# EAGLE design acdr_3.2_updated (EAGLE 7.7.0)
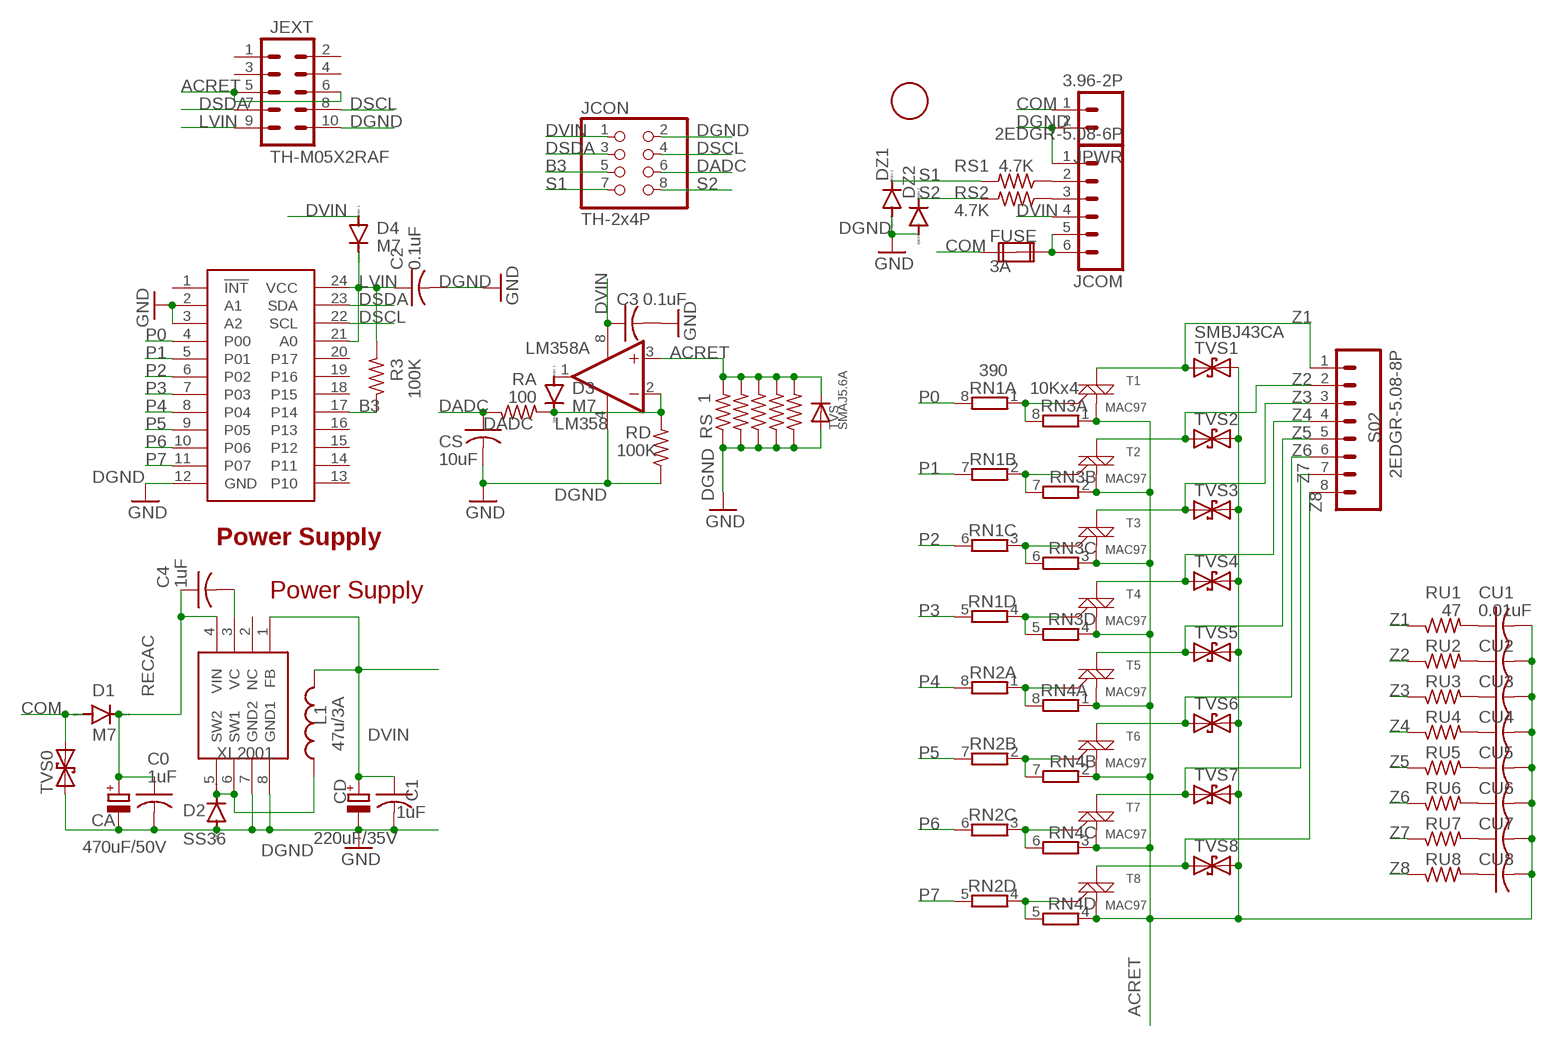
[diagram p0: schematic, sheet 1]

## Parts
1F  FIDUCIAL  [FIDUCIAL_1MM]
C0  1uF  C-USC0603K  [C0603K]
C1  1uF  C-USC0603K  [C0603K]
C2  0.1uF  C-USC0603K  [C0603K]
C3  0.1uF  C-USC0603K  [C0603K]
C4  1uF  C-USC0603K  [C0603K]
CA  470uF/50V  CPOL-EUE5-10.5  [E5-10,5]
CD  220uF/35V  CPOL-EUE3.5-8  [E3,5-8]
CS  10uF  C-USC0805K  [C0805K]
CU1  0.01uF  C-USC0603K  [C0603K]
CU2  0.01uF  C-USC0603K  [C0603K]
CU3  0.01uF  C-USC0603K  [C0603K]
CU4  0.01uF  C-USC0603K  [C0603K]
CU5  0.01uF  C-USC0603K  [C0603K]
CU6  0.01uF  C-USC0603K  [C0603K]
CU7  0.01uF  C-USC0603K  [C0603K]
CU8  0.01uF  C-USC0603K  [C0603K]
D1  M7  DIODE-DO214AC  [DO214AC]
D2  SS36  DIODE-SMB  [SMB]
D3  M7  DIODE-DO214AC  [DO214AC]
D4  M7  DIODE-DO214AC  [DO214AC]
DZ1  ZMM5V1  DIODE-MINIMELF  [MINIMELF]
DZ2  ZMM5V1  DIODE-MINIMELF  [MINIMELF]
FUSE  3A  FUSE2P  [FUSE1]
JCOM  2EDGR-5.08-6P  M065MM  [SCREWTERMINAL-5MM-6]
JCON  TH-2x4P  PINHD-2X4  [2X04]
JEXT  TH-M05X2RAF  M05X2RAF  [2X5-RAF]
JPWR  3.96-2P  M024MM-X  [SCREWTERMINAL-4MM-2-X]
L1  47u/3A  INDUCTORYT1014  [YT1014]
LM358  LM358  OP262D  [SO08]
PCA9555  PCA9555  PCF8575TSSOP24  [TSSOP24]
R3  100K  R-US_R0603  [R0603]
RA  100  R-US_R0603  [R0603]
RD  100K  R-US_R0603  [R0603]
RN1  390  4R-NEXB38V  [EXB38V]
RN2  390  4R-NEXB38V  [EXB38V]
RN3  10Kx4  4R-NEXB38V  [EXB38V]
RN4  10Kx4  4R-NEXB38V  [EXB38V]
RS  1  R-US_R2512  [R2512]
RS1  4.7K  R-US_R0603  [R0603]
RS2  4.7K  R-US_R0603  [R0603]
RSA  1  R-US_R2512  [R2512]
RSB  1  R-US_R2512  [R2512]
RSC  1  R-US_R2512  [R2512]
RSD  1  R-US_R2512  [R2512]
RU1  47  R-US_R0603  [R0603]
RU2  47  R-US_R0603  [R0603]
RU3  47  R-US_R0603  [R0603]
RU4  47  R-US_R0603  [R0603]
RU5  47  R-US_R0603  [R0603]
RU6  47  R-US_R0603  [R0603]
RU7  47  R-US_R0603  [R0603]
RU8  47  R-US_R0603  [R0603]
S02  2EDGR-5.08-8P  M085MM-8  [SCREWTERMINAL-5MM-8]
T1  MAC97  MAC97-3  [TO-92-STRAIGHT]
T2  MAC97  MAC97-3  [TO-92-STRAIGHT]
T3  MAC97  MAC97-3  [TO-92-STRAIGHT]
T4  MAC97  MAC97-3  [TO-92-STRAIGHT]
T5  MAC97  MAC97-3  [TO-92-STRAIGHT]
T6  MAC97  MAC97-3  [TO-92-STRAIGHT]
T7  MAC97  MAC97-3  [TO-92-STRAIGHT]
T8  MAC97  MAC97-3  [TO-92-STRAIGHT]
TVS  SMAJ5.6A  DIODESMA  [SMADIODE]
TVS0  SMBJ43CA  TVSSMB  [SMB]
TVS1  SMBJ43CA  TVSSMB  [SMB]
TVS2  SMBJ43CA  TVSSMB  [SMB]
TVS3  SMBJ43CA  TVSSMB  [SMB]
TVS4  SMBJ43CA  TVSSMB  [SMB]
TVS5  SMBJ43CA  TVSSMB  [SMB]
TVS6  SMBJ43CA  TVSSMB  [SMB]
TVS7  SMBJ43CA  TVSSMB  [SMB]
TVS8  SMBJ43CA  TVSSMB  [SMB]
XL2001  XL2001  [SO08]

## Nets
ACRET: CU1.2 CU2.2 CU3.2 CU4.2 CU5.2 CU6.2 CU7.2 CU8.2 JEXT.5 JEXT.6 LM358.3(A:+IN) RN3.1 RN3.2 RN3.3 RN3.4 RN4.1 RN4.2 RN4.3 RN4.4 RS.2 RSA.2 RSB.2 RSC.2 RSD.2 T1.1(M1) T2.1(M1) T3.1(M1) T4.1(M1) T5.1(M1) T6.1(M1) T7.1(M1) T8.1(M1) TVS1.C TVS2.C TVS3.C TVS4.C TVS5.C TVS6.C TVS7.C TVS8.C TVS.C
B3: JCON.5 PCA9555.17(P14) R3.1
COM [power]: D1.A FUSE.1A JPWR.1 TVS0.C
DADC [signal]: CS.1 JCON.6 RA.1
DGND [power]: C0.2 C1.2 C2.2 C3.2 CA.- CD.- CS.2 D2.A DZ1.A DZ2.A JCOM.1 JCON.2 JEXT.10 JPWR.2 LM358.4(P:V-) PCA9555.2(A1) PCA9555.3(A2) PCA9555.12(GND) RD.1 RS.1 RSA.1 RSB.1 RSC.1 RSD.1 TVS0.A TVS.A XL2001.7(GND2) XL2001.8(GND1) ; supply symbol labelled GND
DSCL [signal]: JCON.4 JEXT.8 PCA9555.22(SCL)
DSDA [signal]: JCON.3 JEXT.7 PCA9555.23(SDA)
DVIN [power]: C1.1 C3.1 CD.+ D4.A JCOM.4 JCON.1 L1.P$2 LM358.8(P:V+) XL2001.1(FB)
FCOM: FUSE.2A JCOM.5 JCOM.6
LVIN [power]: C2.1 D4.C JEXT.9 PCA9555.21(A0) PCA9555.24(VCC) R3.2
N$1: JCOM.2 RS1.1
N$2: CU1.1 RU1.2
N$3: JCOM.3 RS2.1
N$4: CU2.1 RU2.2
N$5: CU3.1 RU3.2
N$6: CU4.1 RU4.2
N$7: D3.C LM358.2(A:-IN) RA.2 RD.2
N$8: RN1.1 RN3.8 T1.2(G)
N$9: RN1.2 RN3.7 T2.2(G)
N$10: CU5.1 RU5.2
N$11: CU6.1 RU6.2
N$12: CU7.1 RU7.2
N$13: CU8.1 RU8.2
N$15: RN1.3 RN3.6 T3.2(G)
N$16: RN1.4 RN3.5 T4.2(G)
N$18: RN2.1 RN4.8 T5.2(G)
N$19: RN2.2 RN4.7 T6.2(G)
N$21: RN2.3 RN4.6 T7.2(G)
N$22: RN2.4 RN4.5 T8.2(G)
N$24: D2.C L1.P$1 XL2001.5(SW2) XL2001.6(SW1)
N$25: C4.2 XL2001.3(VC)
N$43: D3.A LM358.1(A:OUT)
P0: PCA9555.4(P00) RN1.8
P1: PCA9555.5(P01) RN1.7
P2: PCA9555.6(P02) RN1.6
P3: PCA9555.7(P03) RN1.5
P4: PCA9555.8(P04) RN2.8
P5: PCA9555.9(P05) RN2.7
P6: PCA9555.10(P06) RN2.6
P7: PCA9555.11(P07) RN2.5
RECAC [power]: C0.1 C4.1 CA.+ D1.C XL2001.4(VIN)
S1 [signal]: DZ1.C JCON.7 RS1.2
S2 [signal]: DZ2.C JCON.8 RS2.2
Z1 [power]: RU1.1 S02.1 T1.3(M2) TVS1.A
Z2 [power]: RU2.1 S02.2 T2.3(M2) TVS2.A
Z3 [power]: RU3.1 S02.3 T3.3(M2) TVS3.A
Z4 [power]: RU4.1 S02.4 T4.3(M2) TVS4.A
Z5 [power]: RU5.1 S02.5 T5.3(M2) TVS5.A
Z6 [power]: RU6.1 S02.6 T6.3(M2) TVS6.A
Z7 [power]: RU7.1 S02.7 T7.3(M2) TVS7.A
Z8 [power]: RU8.1 S02.8 T8.3(M2) TVS8.A
Unconnected: FUSE.1B FUSE.2B JEXT.1 JEXT.2 JEXT.3 JEXT.4 LM358.5(B:+IN) LM358.6(B:-IN) LM358.7(B:OUT) PCA9555.1(!INT) PCA9555.13(P10) PCA9555.14(P11) PCA9555.15(P12) PCA9555.16(P13) PCA9555.18(P15) PCA9555.19(P16) PCA9555.20(P17) XL2001.2(NC)

## Notes on the sheet
- Power Supply
- Power Supply

## Library data of the parts
1F = adafruitGood:FIDUCIAL: For use by pick and place machines to calibrate the vision/machine, 1mm By microbuilder.eu
C0 C1-C4 CS CU1-CU8 = adafruit:C-US: CAPACITOR, American symbol
CA CD = rcl:CPOL-EU: POLARIZED CAPACITOR, European symbol; SPICEPREFIX: C
D1 D3 D4 DZ1 DZ2 = diode@1:DIODE-: DIODE
D2 = diode:DIODE-: DIODE
FUSE = special:FUSE2P: FUSE 5 x 20 mm
JCOM = SparkFun:M06: Header 6 Standard 6-pin 0.1" header. Use with straight break away headers (SKU : PRT-00116), right angle break away headers (PRT-00553), swiss pins (PRT-00743), machine pins (PRT-00117), and female headers (PRT-00115). Molex polarized connector foot print use with SKU : PRT-08094 with associated crimp pins and housings. NOTES ON THE VARIANTS LOCK and LOCK_LONGPADS... This footprint was designed to help hold the alignment of a through-hole component (i.e. 6-pin header) while soldering it into place. You may notice that each hole has been shifted either up or down by 0.005 of an inch from it's more standard position (which is a perfectly straight line). This slight alteration caused the pins (the squares in the middle) to touch the edges of the holes. Because they are alternating, it causes a "brace" to hold the component in place. 0.005 has proven to be the perfect amount of "off-center" position when using our standard breakaway headers. Although looks a little odd when you look at the bare footprint, once you have a header in there, the alteration is very hard to notice. Also, if you push a header all the way into place, it is covered up entirely on the bottom side. This idea of altering the position of holes to aid alignment will be further integrated into the Sparkfun Library for other footprints. It can help hold any component with 3 or more connection pins.
JCON = pinhead:PINHD-2X4: PIN HEADER
JEXT = SparkFunNew:M05X2: Header 5x2 Standard 10-pin dual row 0.1" header. Commonly used with AVR-ISP. Use with Spark Fun Electronics SKU: PRT-00778
JPWR = SparkFun:M02: Header 2 Standard 2-pin 0.1" header. Use with straight break away headers (SKU : PRT-00116), right angle break away headers (PRT-00553), swiss pins (PRT-00743), machine pins (PRT-00117), and female headers (PRT-00115). Molex polarized connector foot print use with SKU : PRT-08233 with associated crimp pins and housings.
L1 = SparkFunNew:INDUCTOR: Inductors Basic Inductor/Choke - 0603 and 1206. Footprints are not proven and vary greatly between part numbers.
LM358 = linear:OP262: OP AMP
PCA9555 = SparkFunNew:PCF8575
R3 RA RD RS RS1 RS2 RSA RSB RSC RSD RU1-RU8 = adafruit2013:R-US_: RESISTOR, American symbol
RN1-RN4 = resistor-net:4R-N: Array Chip Resistor Source: RS Component / Phycomp; OC_FARNELL: unknown; OC_NEWARK: unknown
S02 = SparkFun:M08: Header 8 Standard 8-pin 0.1" header. Use with straight break away headers (SKU : PRT-00116), right angle break away headers (PRT-00553), swiss pins (PRT-00743), machine pins (PRT-00117), and female headers (PRT-00115).
T1-T8 = SparkFun:MAC97-3
TVS = adafruit:DIODE: Diode SMADIODE - SMA Surface Mount Package 20V 1A Schottky Diode Digikey: 641-1014-6-ND DO-1N4148 - Through Hole Small Current Diode SOD-123 20V 1 A (.5mV Vf) Schottky Diode - Digikey: MBRX120TPMSCT-ND SOD-323 10V 570mA (.38mV Vf, 3ns) Schottky Diode - Digikey: ZLLS410CT-ND SOD-523 30V 30mA Schottky Diode (RB751S-40TE61) - Digikey: RB751S-40TE61CT-ND SOT23-R/W - SOT23 Package (R = Solder Paste/Reflow Ovens, W = Hand-Soldering) BAT54Film 40V 300mA - Digikey: 497-7162-1-ND
TVS0 TVS1-TVS8 = SparkFunNew:TVS
XL2001 = adafruit:XL2001

## Net classes
0 default: width 0.203 mm
1 power: width 0.203 mm
2 relaypower: width 0.203 mm
3 signal: width 0.305 mm
4 adc: width 0.406 mm

## Board
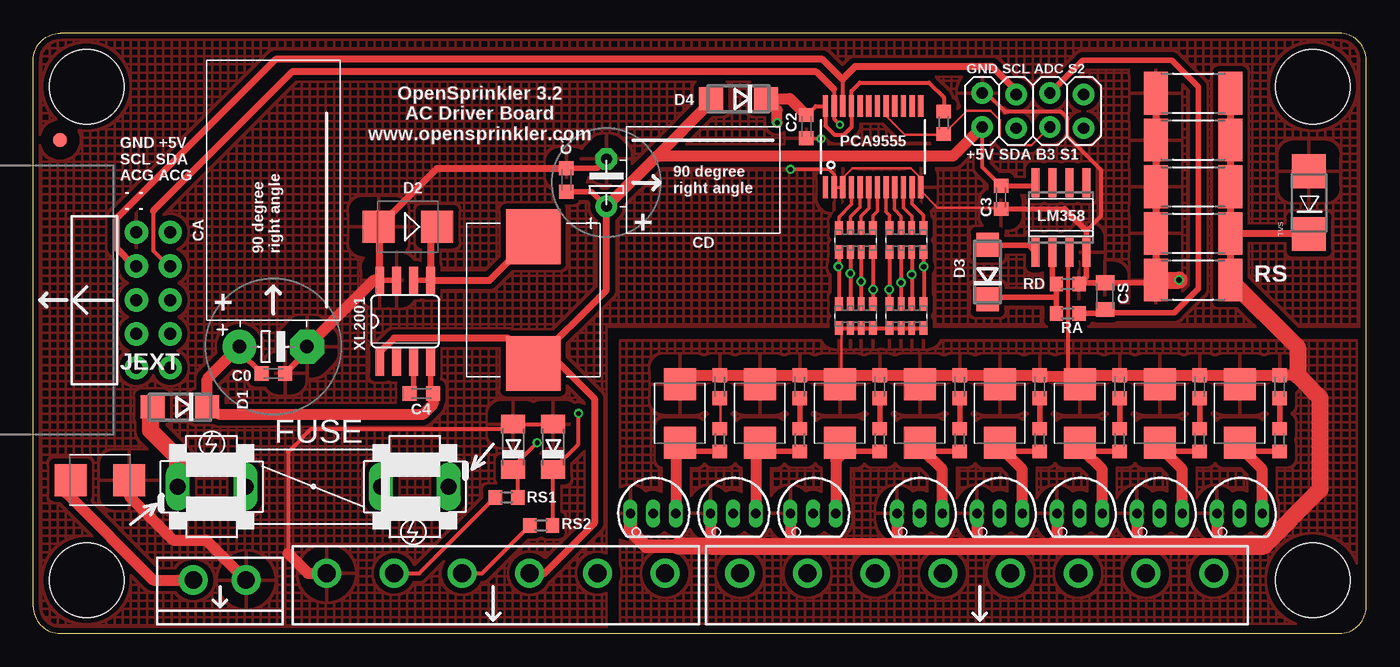
[diagram p1: board, top side]
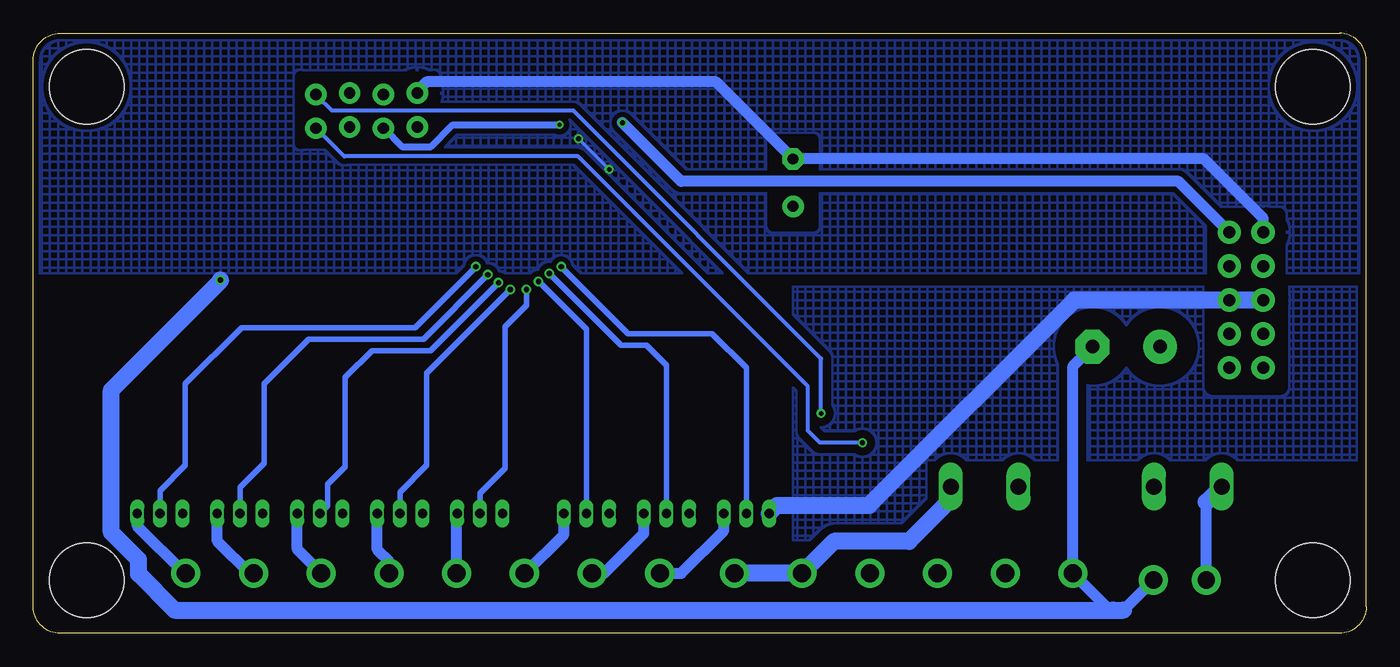
[diagram p2: board, bottom side, seen from below]

Size 100 x 45 mm. Coordinates in mm from the lower left corner, seen from the top.
Outline: 2,0 98,0 arc90 100,2 100,43 arc90 98,45 2,45 arc90 0,43 0,2 arc90 2,0
Copper layers (1*16): Top 0.035mm / dielectric 1.5mm / Bottom 0.035mm
Design rules "Fusion_eagle_rule_v1.1 *": minimum track width 6mil, minimum drill 12mil, track to track 6mil, track to pad 6mil, pad to pad 6mil, via to via 6mil, smd to smd 0mil, copper to edge 10mil, drill to drill 10mil, minimum pad ring 7mil, minimum via ring 6mil, stop-mask expansion 2mil, vias tented up to drill 100mil, thermal gap 40mil
Holes 5.6 mm at 4,4 96,4 4,41 96,41
bRestrict: area 6.5,18.5 to 11.5,31.5; area 41.5,30.5 to 44.5,37; area 70,36.8 to 80,41.8; area 13.3,19.3 to 17.7,23.7; area 18.3,19.3 to 22.7,23.7

### Footprints (pad centres in the part's own frame; a part is rotated, then mirrored left to right if it is on the bottom)
FIDUCIAL_1MM = smd 1 x 1: 1 0,0
C0603K = smd 1.05 x 1.08: 1 -0.875,0; 2 0.875,0
E5-10,5 = drill 1.016 pad 2.54: + -2.54,0 | drill 1.016 pad 2.54 octagon: - 2.54,0
E3,5-8 = drill 0.813 pad 1.6: + -1.778,0 | drill 0.813 pad 1.6 octagon: - 1.778,0
C0805K = smd 1.1 x 1.4: 1 -1,0; 2 1,0
DO214AC = smd 1.8 x 1.7: A 2.05,0; C -2.05,0
SMB = smd 2.4 x 2.4: A 2.2,0; C -2.2,0
MINIMELF = smd 1.4 x 1.8: A 1.7,0; C -1.7,0
FUSE1 = drill 1.194 long: 1A -10.16,0; 1B -5.08,0; 2A 10.16,0; 2B 5.08,0
SCREWTERMINAL-5MM-6 = drill 1.35 pad 2.184: 1 0,0; 2 5.08,0; 3 10.16,0; 4 15.24,0; 5 20.32,0; 6 25.4,0
2X04 = drill 0.85 pad 1.6: 1 -3.81,-1.219; 2 -3.81,1.321; 3 -1.27,-1.321; 4 -1.27,1.219; 5 1.27,-1.219; 6 1.27,1.321; 7 3.81,-1.321; 8 3.81,1.219
2X5-RAF = drill 0.9 pad 1.75: 1 5.08,1.27; 2 5.08,-1.27; 3 2.54,1.27; 4 2.54,-1.27; 5 0,1.27; 6 0,-1.27; 7 -2.54,1.27; 8 -2.54,-1.27; 9 -5.08,1.27; 10 -5.08,-1.27
SCREWTERMINAL-4MM-2-X = drill 1.3 pad 2.184: 1 0,0; 2 3.96,0
YT1014 = smd 4.1 x 4.1: P$1 -4.75,0; P$2 4.75,0
SO08 = smd 0.6 x 2.2: 1 -1.905,-2.6; 2 -0.635,-2.6; 3 0.635,-2.6; 4 1.905,-2.6; 5 1.905,2.6; 6 0.635,2.6; 7 -0.635,2.6; 8 -1.905,2.6
TSSOP24 = smd 0.4 x 1.65: 1 -3.575,-3.05; 2 -2.925,-3.05; 3 -2.275,-3.05; 4 -1.625,-3.05; 5 -0.975,-3.05; 6 -0.325,-3.05; 7 0.325,-3.05; 8 0.975,-3.05; 9 1.625,-3.05; 10 2.275,-3.05; 11 2.925,-3.05; 12 3.575,-3.05; 13 3.575,3.05; 14 2.925,3.05; 15 2.275,3.05; 16 1.625,3.05; 17 0.975,3.05; 18 0.325,3.05; 19 -0.325,3.05; 20 -0.975,3.05; 21 -1.625,3.05; 22 -2.275,3.05; 23 -2.925,3.05; 24 -3.575,3.05
R0603 = smd 1 x 1.1: 1 -0.85,0; 2 0.85,0
EXB38V = smd 0.6 x 1: 1 -1.275,-0.9; 4 1.275,-0.9; 5 1.275,0.9; 8 -1.275,0.9 | smd 0.5 x 1: 2 -0.4,-0.9; 3 0.4,-0.9; 6 0.4,0.9; 7 -0.4,0.9
R2512 = smd 1.8 x 3.2: 1 -2.8,0; 2 2.8,0
SCREWTERMINAL-5MM-8 = drill 1.35 pad 2.184: 1 0,0; 2 5.08,0; 3 10.16,0; 4 15.24,0; 5 20.32,0; 6 25.4,0; 7 30.48,0; 8 35.56,0
TO-92-STRAIGHT = drill 0.7 pad 1 long: 1 -1.7,0; 2 0,0; 3 1.7,0
SMADIODE = smd 2.54 x 2.54: A 2.349,0; C -2.349,0
SO08' = smd 0.66 x 2.032: 1 -1.905,-3.073; 2 -0.635,-3.073; 3 0.635,-3.073; 4 1.905,-3.073; 5 1.905,3.073; 6 0.635,3.073; 7 -0.635,3.073; 8 -1.905,3.073

### Placement (x,y rotation side)
1F  2,37 0 top
C0  18,19.5 0 top
C1  40,34 90 top
C2  58,38 270 top
C3  72.6,32.7 270 top
C4  29.1,18 180 top
CA  18,21.5 0 top
CD  43,33.8 90 top
CS  80.4,25.3 90 top
CU1  51.5,18.5 90 top
CU2  57.5,18.5 90 top
CU3  63.5,18.5 90 top
CU4  69.5,18.5 90 top
CU5  75.5,18.5 90 top
CU6  81.5,18.5 90 top
CU7  87.5,18.5 90 top
CU8  93.5,18.5 90 top
D1  11,17 180 top
D2  28.1,30.5 180 top
D3  71.6,27.1 90 top
D4  52.9,40.1 180 top
DZ1  36,14 90 top
DZ2  39,14 90 top
FUSE  21,11 0 top
JCOM  22,4.5 0 top
JCON  75,39.2 0 top
JEXT  9,25 270 top
JPWR  12,4 0 top
L1  37.5,25 270 top
LM358  77.1,31.2 0 top
PCA9555  63,36.5 0 top
R3  68.3,38.3 90 top
RA  77.6,24 180 top
RD  77.6,26.2 180 top
RN1  61.7,29.5 0 top
RN2  65.5,29.5 0 top
RN3  61.7,23.8 0 top
RN4  65.5,23.8 0 top
RS  87,26.5 0 top
RS1  35.5,10.2 0 top
RS2  38.1,8.1 0 top
RSA  87,30 0 top
RSB  87,33.5 0 top
RSC  87,37 0 top
RSD  87,40.5 0 top
RU1  51.5,14.5 90 top
RU2  57.5,14.5 90 top
RU3  63.5,14.5 90 top
RU4  69.5,14.5 90 top
RU5  75.5,14.5 90 top
RU6  81.5,14.5 90 top
RU7  87.5,14.5 90 top
RU8  93.5,14.5 90 top
S02  53,4.5 0 top
T1  46.5,9 0 top
T2  52.5,9 0 top
T3  58.5,9 0 top
T4  66.5,9 0 top
T5  72.5,9 0 top
T6  78.5,9 0 top
T7  84.5,9 0 top
T8  90.5,9 0 top
TVS  95.7,32.3 90 top
TVS0  5,11.5 0 top
TVS1  48.5,16.5 270 top
TVS2  54.5,16.5 270 top
TVS3  60.5,16.5 270 top
TVS4  66.5,16.5 270 top
TVS5  72.5,16.5 270 top
TVS6  78.5,16.5 270 top
TVS7  84.5,16.5 270 top
TVS8  90.5,16.5 270 top
XL2001  XL2001  [SO08']  27.9,23.4 0 top

### Tracks (layer width: path | path; a pad name or v marks a point on that pad's centre or on a via)
ACRET
  Top 0.203: 60.2,19.35 60.01,19.38 TVS3.C 60.63,18.83 60.63,22.76 RN3.1 | 90.5,19.45 90.5,19.47 TVS8.C | 72.1,19.35 72.1,19.38 TVS5.C
  Top 0.305: RN3.1 RN3.2 RN3.3 RN3.4 RN4.1 RN4.2 RN4.3 RN4.4 | TVS6.C 77.6,19.55 77.6,28.52 LM358.3
  Top 0.406: 60.9,19.1 61.15,19.35
  Top 0.508: RSD.2 RSC.2 RSB.2 RSA.2 | RSA.2 RS.2 | RSA.2 95.65,30 TVS.C
  Top 0.813: 94.85,19.35 CU8.2 91.15,19.35 TVS8.C 90.5,19 | TVS3.C 60.5,19.5 60.35,19.35 60.2,19.35 CU2.2 55.15,19.35 TVS2.C 54.5,19 54.15,19.35 CU1.2 49.15,19.35 TVS1.C | TVS3.C 60.9,19.1 | 90.5,19 90.5,19.45 | TVS3.C 61.15,19.35 CU3.2 66.15,19.35 66.5,19 TVS4.C 67.15,19.35 CU4.2 72.1,19.35 | TVS5.C 73.15,19.35 CU5.2 75.55,19.3 78.5,19.3 TVS6.C 79.15,19.35 CU6.2 83.85,19.35 TVS7.C 85.15,19.35 CU7.2 90.15,19.35 90.5,19 | T2.1 50.8,6.55 | T3.1 56.8,6.55 | T4.1 64.8,6.85 64.5,6.55 | T5.1 70.8,6.75 70.6,6.55 | T6.1 76.8,6.95 76.4,6.55 | T7.1 82.8,6.65 82.7,6.55 | T8.1 88.8,6.75 88.6,6.55
  Top 1.016: 48.4,6.55 45.95,6.55 44.8,7.7 T1.1
  Top 1.27: 48.4,6.55 50.8,6.55 56.8,6.55 64.5,6.55 70.6,6.55 76.4,6.55 82.7,6.55 88.6,6.55 92.3,6.55 96.55,10.8 96.55,17.65 94.85,19.35 94.85,21.45 RS.2
  Bottom 1.27: JEXT.6 JEXT.5 21.9,25 37.3,9.6 44.2,9.6 T1.1
  pour Top (isolate 0.61, hatched): 44,0 100,0 100,22 44,22
  pour Bottom (isolate 0.61, hatched): 43,7 33,7 33,13 0,13 0,26 43,26
B3
  Top 0.203: PCA9555.17 64.01,39.47 64.01,38.8 65.4,37.41 68.25,37.41 R3.1 70.05,39.2 71.8,39.2 72.5,38.5 72.5,37.2 73.1,36.6 74.89,36.6 JCON.5
COM
  Top 0.813: TVS0.C 2.5,11.2 2.5,10.5 9,4 JPWR.1
  Top 1.27: FUSE.1A 10.84,13.16 8.8,15.2 8.8,16.97 D1.A
  Bottom 0.813: JPWR.1 12,4.7 12,9.84
  Bottom 1.27: 12,9.84 FUSE.1A
DADC
  Top 0.305: CS.1 80.81,24.3
  Top 0.406: RA.1 80.1,24 CS.1 | 80.81,24.3 81.08,24.04 85.62,24.04 87.42,25.84 87.42,40.98 85.4,43 78.75,43 JCON.6
DGND  (via drill 0.35, 0.4)
  Top 0.203: PCA9555.2 60.1,33.43 60.72,33.43 PCA9555.3 60.81,33.52 60.81,34.23 61.46,34.88 65.84,34.88 66.5,34.23 66.5,33.52 PCA9555.12 66.58,33.18 67.84,31.91 72.45,31.91 C3.2
  Top 0.254: C2.2 58.05,37.1 v59.1,37.1 | v56.8,34.8 59.7,34.8 60.1,34.4 60.1,33.43
  Top 0.305: JCON.2 71.52,40.52 72.92,39.12 77.13,39.12 77.54,38.7 77.54,37.32 80.1,34.76 80.1,31.29 79,30.2 | DZ2.A DZ1.A 35.6,15.3 20.8,15.3 19.1,13.6 19.1,6
  Top 0.406: C0.2 20.54,21.16 CA.- | C1.2 42.3,34.88 CD.- | C3.2 77.35,31.85 79,30.2 LM358.4 79,26.75 RD.1 78.55,26.3 CS.2 84,26.3 84.1,26.4 | XL2001.8 XL2001.7
  Top 0.508: XL2001.8 26,30.41 D2.A 30.27,34.88 C1.2 | RSD.1 RSC.1 RSB.1 RSA.1 RS.1 84.1,26.4
  Top 0.813: CA.- 25.51,26.47 XL2001.8 | TVS0.A 7.2,10.3 10.5,7 12.96,7 JPWR.2 | 19.1,6 20.6,4.5 JCOM.1
  Top 1.27: RS.1 v85.95,26.5
  Bottom 0.254: v59.1,37.1 v56.8,34.8
  Bottom 0.813: CA.- 22,20.04 JCOM.1 19.25,1.75 19,1.75 | JEXT.10 7.73,31.13 12.18,35.58 CD.- 48.77,41.35 70.5,41.35 71.19,40.66 JCON.2 | 18.21,1.75 JPWR.2
  Bottom 1.27: v85.95,26.5 85.95,26.45 94.15,18.25 94.15,7.57 92.11,5.53 92.11,4.46 89.4,1.75 19,1.75 18.21,1.75
  pour Top (isolate 0.406, hatched): -0.1,45 100,45 100,23 43,23 43,0 -0.1,0
  pour Bottom (isolate 0.406, hatched): 0,45 100,45 100,27 44,27 0,27
DSCL
  Top 0.305: 60.71,41.55 60.71,39.57 PCA9555.22 | JEXT.8 7.56,27.54
  Top 0.508: JCON.4 73.73,40.72 71.95,42.49 61.65,42.49 60.71,41.55 59.21,43.05 18.17,43.05 6.2,31.08 6.2,28.9 7.56,27.54
DSDA  (via drill 0.3)
  Top 0.305: v60.52,38.14 60.1,38.56 60.1,39.47 PCA9555.23 60.06,39.57 60.06,40.81 | JEXT.7 10.14,27.54 9,28.7 9,31.69
  Top 0.508: 9,31.69 19.4,42.12 58.75,42.12 60.06,40.81
  Bottom 0.305: 73.7,37.87 JCON.3
  Bottom 0.508: v60.52,38.14 68.53,38.14 70.16,36.51 72.33,36.51 73.7,37.87
DVIN
  Top 0.305: C3.1 71.19,34.96 JCON.1
  Top 0.406: C1.1 41.9,33.12 CD.+ | C3.1 74.94,33.55 LM358.8
  Top 0.508: L1.P$2 35.6,22.15 27.05,22.15 25.95,21.05 25.95,20.37 XL2001.1 | L1.P$2 43,25.75 CD.+ | L1.P$2 39.45,20.25 42.1,17.6 42.1,8.26 38.34,4.5 JCOM.4
  Top 0.813: CD.+ 46.78,35.8 | 46.78,35.8 50.85,39.87 D4.A | JCON.1 69.01,35.8 46.78,35.8
FCOM
  Bottom 1.27: JCOM.6 JCOM.5 39.92,6.9 34.3,6.9 31.16,10.04 FUSE.2A
LVIN  (via drill 0.35)
  Top 0.305: C2.1 58.7,39.55 PCA9555.24 59.42,38.08 60.1,37.4 60.8,37.4 61.4,38 61.4,39.52 PCA9555.21 61.38,40.67 62,41.3 67.2,41.3 68.3,40.2 R3.2
  Top 0.813: C2.1 56.75,40.1 D4.C 55.8,39.25 v55.8,38.3
  Bottom 0.813: JEXT.9 14.09,33.9 51.4,33.9 v55.8,38.3
N$1
  Top 0.305: JCOM.2 28.95,4.5 RS1.1
N$2
  Top 0.203: RU1.2 51.56,15.38 51.56,17.6 CU1.1
N$3
  Top 0.305: JCOM.3 33.65,4.5 RS2.1
N$4
  Top 0.406: CU2.1 RU2.2
N$5
  Top 0.406: CU3.1 RU3.2
N$6
  Top 0.406: CU4.1 RU4.2
N$7
  Top 0.406: 76.75,25.2 RD.2 76.47,26.48 LM358.2 | 76.75,25.2 RA.2 | D3.C 71.75,25.2 76.75,25.2
N$8  (via drill 0.4)
  Top 0.305: RN1.1 60.42,27.52 v60.4,27.5 60.42,27.48 RN3.8
  Bottom 0.406: v60.4,27.5 55.37,22.47 49.06,22.47 46.5,19.91 T1.2
N$9  (via drill 0.4)
  Top 0.305: RN1.2 v61.3,27 RN3.7
  Bottom 0.406: v61.3,27 55.91,21.61 54.01,21.61 52.5,20.11 T2.2
N$10
  Top 0.406: CU5.1 RU5.2
N$11
  Top 0.406: CU6.1 RU6.2
N$12
  Top 0.406: CU7.1 RU7.2
N$13
  Top 0.406: CU8.1 RU8.2
N$15  (via drill 0.4)
  Top 0.305: RN1.3 v62.1,26.4 RN3.6
  Bottom 0.406: T3.2 58.5,22.8 v62.1,26.4
N$16  (via drill 0.4)
  Top 0.305: RN1.4 63,28.57 v63,25.8 63,24.73 RN3.5
  Bottom 0.406: v63,25.8 63,24.6 64.6,23 64.6,12.4 66.5,10.5 T4.2
N$18  (via drill 0.4)
  Top 0.305: RN2.1 64.22,25.82 v64.2,25.8 64.2,24.73 RN4.8
  Bottom 0.305: v64.2,25.8 v64.21,25.8
  Bottom 0.406: v64.21,25.8 70.5,19.5 70.5,12.6 72.5,10.6 T5.2
N$19  (via drill 0.4)
  Top 0.305: RN2.2 v65.1,26.3 RN4.7
  Bottom 0.406: v65.1,26.3 70.19,21.21 74.59,21.21 76.6,19.21 76.6,12.51 77.93,11.17 77.93,9.57 T6.2
N$21  (via drill 0.4)
  Top 0.305: RN2.3 v65.9,26.9 RN4.6
  Bottom 0.406: v65.9,26.9 70.73,22.07 79.34,22.07 82.69,18.71 82.69,12.77 84.5,10.97 T7.2
N$22  (via drill 0.4)
  Top 0.305: RN2.4 66.78,27.52 v66.8,27.5 66.8,24.73 RN4.5
  Bottom 0.406: v66.8,27.5 71.37,22.93 84.38,22.93 88.61,18.7 88.61,12.6 90.5,10.7 T8.2
N$24
  Top 0.406: XL2001.6 XL2001.5
  Top 0.508: L1.P$1 34.22,26.47 XL2001.5 29.8,30 D2.C
N$25
  Top 0.406: C4.2 28.54,18.31 XL2001.3
N$43
  Top 0.406: LM358.1 74.69,29.1 71.71,29.1 D3.A
P0
  Top 0.254: RN1.8 60.42,31.23 61.38,32.17 PCA9555.4
P1
  Top 0.254: RN1.7 61.3,31.25 62.02,31.98 PCA9555.5
P2
  Top 0.254: RN1.6 62.1,31.3 62.67,31.88 PCA9555.6
P3
  Top 0.254: RN1.5 62.98,31.32 63.33,31.68 PCA9555.7
P4
  Top 0.254: RN2.8 64.22,31.38 63.98,31.62 PCA9555.8
P5
  Top 0.254: RN2.7 65.1,31.3 64.6,31.8 64.6,33.42 PCA9555.9
P6
  Top 0.254: RN2.6 65.9,31.3 65.28,31.93 PCA9555.10
P7
  Top 0.254: RN2.5 66.78,31.38 65.92,32.23 PCA9555.11
RECAC
  Top 0.406: C4.1 29.8,18.17 XL2001.4 | C0.1 15.46,21.16
  Top 0.813: C4.1 29.98,17.18 29.2,16.4 13.95,16.4 D1.C 13.05,19.09 CA.+ 15.46,21.16
S1  (via drill 0.35)
  Top 0.305: RS1.2 36.35,11.95 DZ1.C 36,12.5 v37.8,14.3
  Bottom 0.305: JCON.7 78.77,37.87 76.67,35.77 59.14,35.77 41.9,18.53 41.9,15.2 41,14.3 v37.8,14.3
S2  (via drill 0.35)
  Top 0.305: RS2.2 39,8.15 DZ2.C 40.9,14.2 v40.9,16.5
  Bottom 0.305: JCON.8 78.77,40.36 77.6,39.19 59.48,39.19 40.9,20.61 v40.9,16.5
Z1
  Top 0.406: RU1.1 49.15,13.65 48.6,14.2 TVS1.A
  Top 0.813: 48.6,14.2 48.2,13.8 T1.3
  Bottom 0.813: S02.1 51.4,4.5 48.2,7.7 T1.3
Z2
  Top 0.406: TVS2.A 54.67,14.12 55.15,13.65 RU2.1
  Top 0.813: 54.67,14.12 54.2,13.65 T2.3
  Bottom 0.813: S02.2 57.2,4.5 54.2,7.5 T2.3
Z3
  Top 0.406: TVS3.A 61,13.8 61.15,13.65 RU3.1
  Top 0.813: 61,13.8 60.2,13 T3.3
  Bottom 0.813: S02.3 63.1,4.5 60.2,7.4 T3.3
Z4
  Top 0.406: TVS4.A 66.75,14.05 67.15,13.65 RU4.1
  Top 0.813: T4.3 68.2,12.3 66.75,13.75 66.75,14.05
  Bottom 0.813: S02.4 68.24,9 68.22,9.02 T4.3
Z5
  Top 0.406: TVS5.A 72.65,14.15 73.15,13.65 RU5.1
  Top 0.813: T5.3 74.2,12.3 72.65,13.85 72.65,14.15
  Bottom 0.813: S02.5 73.32,5.4 74.2,6.28 T5.3
Z6
  Top 0.406: TVS6.A 78.83,13.97 79.15,13.65 RU6.1
  Top 0.813: T6.3 80.2,12.3 78.83,13.68 78.83,13.97
  Bottom 0.813: S02.6 80.2,6.3 T6.3
Z7
  Top 0.406: TVS7.A 84.7,14.1 85.15,13.65 RU7.1
  Top 0.813: T7.3 86.2,12.3 84.7,13.8 84.7,14.1
  Bottom 0.813: S02.7 83.78,4.5 86.2,6.92 T7.3
Z8
  Top 0.406: TVS8.A 90.8,14 91.15,13.65 RU8.1
  Top 0.813: T8.3 92.2,12.3 90.8,13.7 90.8,14
  Bottom 0.813: S02.8 88.65,4.5 92.2,8.05 T8.3

### Text on the board
tPlace: 90 degree / right angle | + | 90 degree / right angle | +
tNames: GND SCL ADC S2 | OpenSprinkler 3.2 / AC Driver Board / www.opensprinkler.com | +5V SDA B3 S1 | GND +5V / SCL SDA / ACG ACG / - - / - -